# EasyEDA schematic SCH_280049核心板.json
TITLE: Sheet_1; REV: 1.0; Date: 2025-02-15; Sheet: 1/1; Drawn By: Qu♂; Company: Your Company
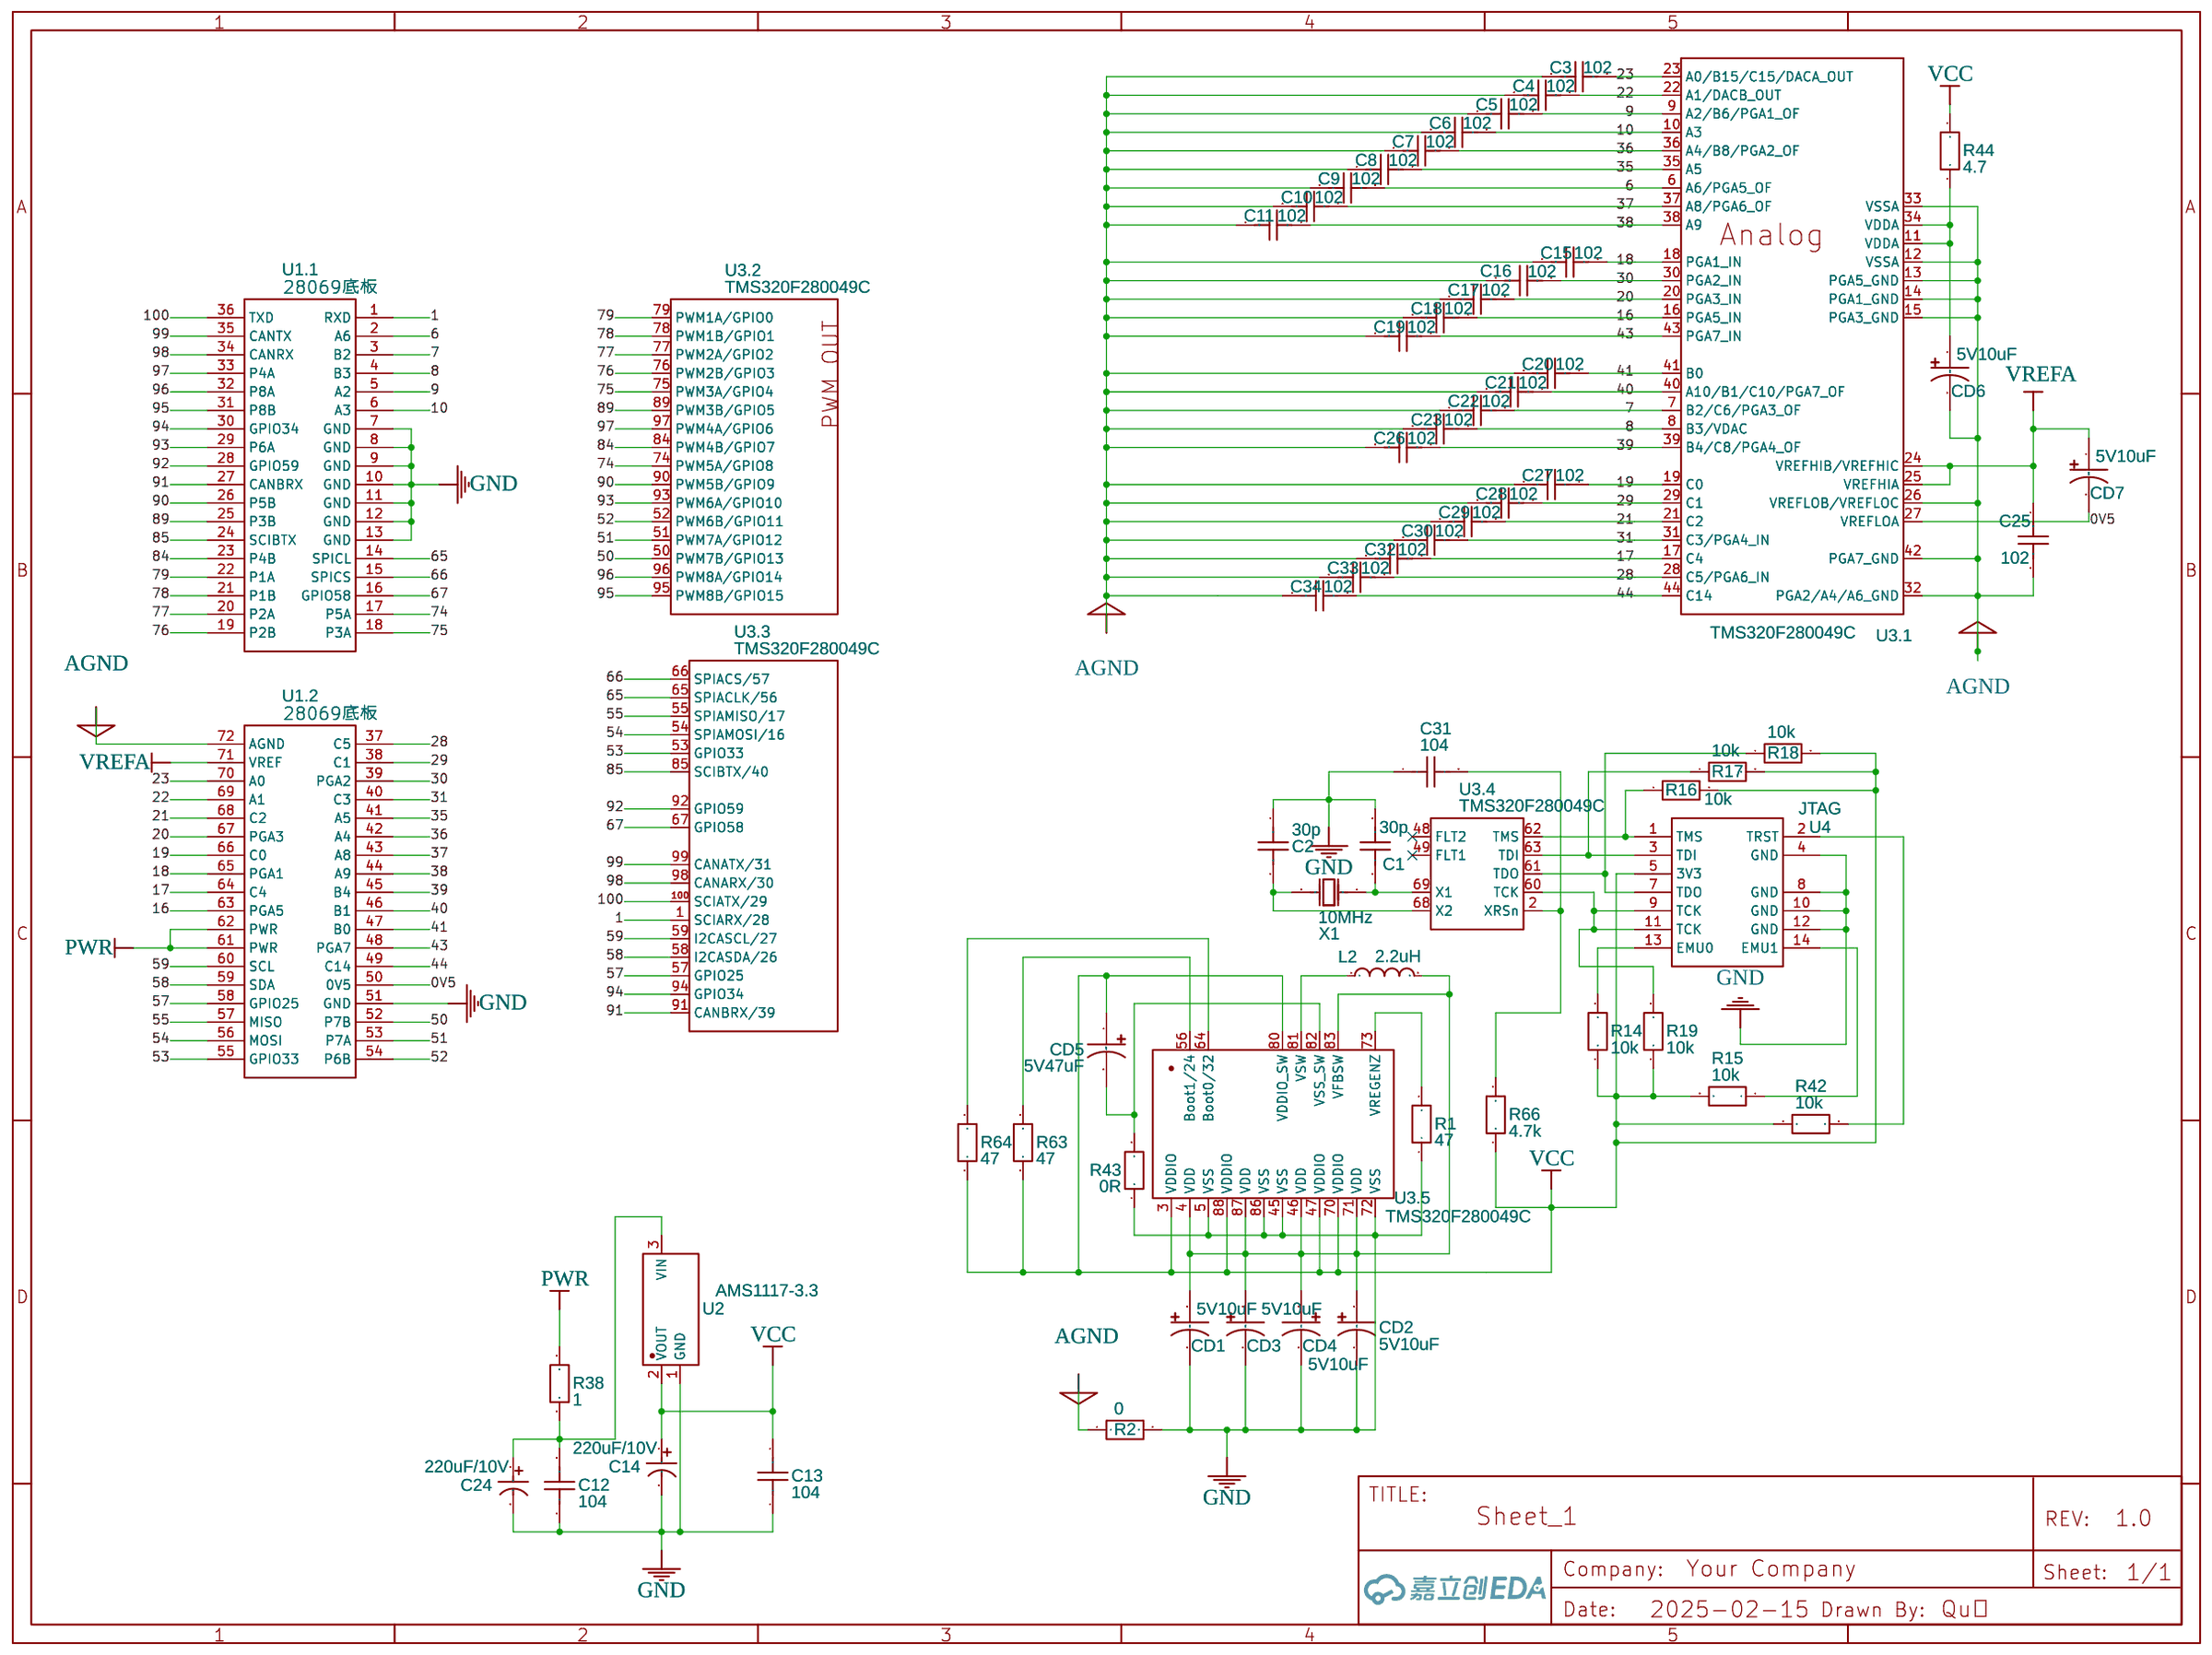
[diagram p0: schematic sheet]

## Parts
C1  30p  [C0402]
C2  30p  [C0402]
C3  102  [C0805]
C4  102  [C0805]
C5  102  [C0805]
C6  102  [C0805]
C7  102  [C0805]
C8  102  [C0805]
C9  102  [C0805]
C10  102  [C0805]
C11  102  [C0805]
C12  104  [C0603]
C13  104  [C0603]
C14  220uF/10V  [CAP-SMD_BD6.3-L6.6-W6.6-LS7.2-FD]
C15  102  [C0805]
C16  102  [C0805]
C17  102  [C0805]
C18  102  [C0805]
C19  102  [C0805]
C20  102  [C0805]
C21  102  [C0805]
C22  102  [C0805]
C23  102  [C0805]
C24  220uF/10V  [CAP-SMD_BD6.3-L6.6-W6.6-LS7.2-FD]
C25  102  [C0805]
C26  102  [C0805]
C27  102  [C0805]
C28  102  [C0805]
C29  102  [C0805]
C30  102  [C0805]
C31  104  [C0805]
C32  102  [C0805]
C33  102  [C0805]
C34  102  [C0805]
CD1  5V10uF  [CAP-SMD_L3.2-W1.6]
CD2  5V10uF  [CAP-SMD_L3.2-W1.6]
CD3  5V10uF  [CAP-SMD_L3.2-W1.6]
CD4  5V10uF  [CAP-SMD_L3.2-W1.6]
CD5  5V47uF  [CAP-SMD_L3.2-W1.6]
CD6  5V10uF  [CAP-SMD_L3.2-W1.6]
CD7  5V10uF  [CAP-SMD_L3.2-W1.6]
L2  2.2uH  [IND-SMD_L4.0-W4.0]
R1  47  [R0805]
R2  0  [R0805]
R14  10k  [R0805]
R15  10k  [R0805]
R16  10k  [R0805]
R17  10k  [R0805]
R18  10k  [R0805]
R19  10k  [R0805]
R38  1  [R0805]
R42  10k  [R0805]
R43  0R  [R0805]
R44  4.7  [R0805]
R63  47  [R0805]
R64  47  [R0805]
R66  4.7k  [R0805]
U1  28069底板  [280049底板]  (sections 1,2)
U2  AMS1117-3.3  [SOT-89-3_L4.5-W2.5-P1.50-LS4.2-BR]
U3  TMS320F280049C  [LQFP-100_L14.0-W14.0-P0.50-LS16.0-BL]  (sections 1,2,3,4,5)
U4  JTAG  [JTAG]
X1  10MHz  [HC-49S_L11.4-W4.8]

## Library data of the parts
C1 C2 = C_0402_US: Contributor: LCEDA_Lib
C3-C11 C15-C23 C25-C34 = C_0805_US: Contributor: LCEDA_Lib
C12 C13 = C_0603_US: Contributor: LCEDA_Lib
C14 C24 = 固态电容220UF/10V6.3*5.4: Contributor: LCSC; Supplier: LCSC; Supplier Part: C9900001736; Manufacturer Part: 固态电容220uF/10V6.3*5.4; JLCPCB Part Class: Extended Part; Manufacturer: null
CD1-CD7 = 5V10UF钽电容-3528: Contributor: LCSC; Supplier: LCSC; Supplier Part: C9900010526; Manufacturer: null; Manufacturer Part: 5v10uf钽电容-3528
L2 = ASPIAIG-S4035-2R2M-T: Supplier: LCSC; Supplier Part: C7217583; Manufacturer: ABRACON; Contributor: lcsc; JLCPCB Part Class: Extended Part
R1 R2 R14-R19 R38 R42-R44 R63 R64 R66 = R_0805_EU: Contributor: LCEDA_Lib
U1 = 28069底板: Contributor: Qu♂; subpart_no: 1
U2 = AMS1117-1.2S: Supplier: LCSC; Supplier Part: C5354987; Manufacturer: UMW(友台半导体); JLCPCB Part Class: Extended Part; Contributor: lcsc
U3 = TMS320F280049C: Manufacturer: TI(德州仪器); Manufacturer Part: 280049; subpart_no: 1; Contributor: paking_zhang; JLCPCB Part Class: Extended Part
U4 = JTAG: Contributor: paking_zhang
X1 = E49B11E0X000YE10C0: Contributor: LCSC; Supplier: LCSC; Manufacturer: HOSONIC(鸿星); Supplier Part: C126792; JLCPCB Part Class: Extended Part

## Nets
0V5: CD7.2 U1.50(0V5) U3.27(VREFLOA)
AGND: C3.2 C4.2 C5.2 C6.2 C7.2 C8.2 C9.2 C10.2 C11.2 C15.2 C16.2 C17.2 C18.2 C19.2 C20.2 C21.2 C22.2 C23.2 C25.2 C26.2 C27.2 C28.2 C29.2 C30.2 C32.2 C33.2 C34.2 CD6.2 R2.1 U1.72(AGND) U3.12(VSSA) U3.13(PGA5_GND) U3.14(PGA1_GND) U3.15(PGA3_GND) U3.26(VREFLOB/VREFLOC) U3.32(PGA2/A4/A6_GND) U3.33(VSSA) U3.42(PGA7_GND)
GND: C1.2 C2.1 C12.1 C13.1 C14.2 C24.2 C31.1 CD1.2 CD2.2 CD3.2 CD4.2 R1.1 R2.2 R43.1 U1.7(GND) U1.8(GND) U1.9(GND) U1.10(GND) U1.11(GND) U1.12(GND) U1.13(GND) U1.51(GND) U2.1(GND) U3.5(VSS) U3.45(VSS) U3.72(VSS) U3.86(VSS) U4.4(GND) U4.8(GND) U4.10(GND) U4.12(GND)
VCC: C13.2 C14.1 CD5.1 R14.1 R15.2 R16.2 R17.2 R18.2 R19.1 R42.2 R44.1 R63.1 R64.1 R66.1 U2.2(VOUT) U3.3(VDDIO) U3.47(VDDIO) U3.70(VDDIO) U3.80(VDDIO_SW) U3.88(VDDIO) U4.5(3V3)
1: U1.1(RXD) U3.1(SCIARX/28)
6: C9.1 U1.2(A6) U3.6(A6/PGA5_OF)
7: C22.1 U1.3(B2) U3.7(B2/C6/PGA3_OF)
8: C23.1 U1.4(B3) U3.8(B3/VDAC)
9: C5.1 U1.5(A2) U3.9(A2/B6/PGA1_OF)
10: C6.1 U1.6(A3) U3.10(A3)
16: C18.1 U1.63(PGA5) U3.16(PGA5_IN)
17: C32.1 U1.64(C4) U3.17(C4)
18: C15.1 U1.65(PGA1) U3.18(PGA1_IN)
19: C27.1 U1.66(C0) U3.19(C0)
20: C17.1 U1.67(PGA3) U3.20(PGA3_IN)
21: C29.1 U1.68(C2) U3.21(C2)
22: C4.1 U1.69(A1) U3.22(A1/DACB_OUT)
23: C3.1 U1.70(A0) U3.23(A0/B15/C15/DACA_OUT)
28: C33.1 U1.37(C5) U3.28(C5/PGA6_IN)
29: C28.1 U1.38(C1) U3.29(C1)
30: C16.1 U1.39(PGA2) U3.30(PGA2_IN)
31: C30.1 U1.40(C3) U3.31(C3/PGA4_IN)
35: C8.1 U1.41(A5) U3.35(A5)
36: C7.1 U1.42(A4) U3.36(A4/B8/PGA2_OF)
37: C10.1 U1.43(A8) U3.37(A8/PGA6_OF)
38: C11.1 U1.44(A9) U3.38(A9)
39: C26.1 U1.45(B4) U3.39(B4/C8/PGA4_OF)
40: C21.1 U1.46(B1) U3.40(A10/B1/C10/PGA7_OF)
41: C20.1 U1.47(B0) U3.41(B0)
43: C19.1 U1.48(PGA7) U3.43(PGA7_IN)
44: C34.1 U1.49(C14) U3.44(C14)
50: U1.52(P7B) U3.50(PWM7B/GPIO13)
51: U1.53(P7A) U3.51(PWM7A/GPIO12)
52: U1.54(P6B) U3.52(PWM6B/GPIO11)
53: U1.55(GPIO33) U3.53(GPIO33)
54: U1.56(MOSI) U3.54(SPIAMOSI/16)
55: U1.57(MISO) U3.55(SPIAMISO/17)
57: U1.58(GPIO25) U3.57(GPIO25)
58: U1.59(SDA) U3.58(I2CASDA/26)
59: U1.60(SCL) U3.59(I2CASCL/27)
65: U1.14(SPICL) U3.65(SPIACLK/56)
66: U1.15(SPICS) U3.66(SPIACS/57)
67: U1.16(GPIO58) U3.67(GPIO58)
74: U1.17(P5A) U3.74(PWM5A/GPIO8)
75: U1.18(P3A) U3.75(PWM3A/GPIO4)
76: U1.19(P2B) U3.76(PWM2B/GPIO3)
77: U1.20(P2A) U3.77(PWM2A/GPIO2)
78: U1.21(P1B) U3.78(PWM1B/GPIO1)
79: U1.22(P1A) U3.79(PWM1A/GPIO0)
84: U1.23(P4B) U3.84(PWM4B/GPIO7)
85: U1.24(SCIBTX) U3.85(SCIBTX/40)
89: U1.25(P3B) U3.89(PWM3B/GPIO5)
90: U1.26(P5B) U3.90(PWM5B/GPIO9)
91: U1.27(CANBRX) U3.91(CANBRX/39)
92: U1.28(GPIO59) U3.92(GPIO59)
93: U1.29(P6A) U3.93(PWM6A/GPIO10)
94: U1.30(GPIO34) U3.94(GPIO34)
95: U1.31(P8B) U3.95(PWM8B/GPIO15)
96: U1.32(P8A) U3.96(PWM8A/GPIO14)
97: U1.33(P4A) U3.97(PWM4A/GPIO6)
98: U1.34(CANRX) U3.98(CANARX/30)
99: U1.35(CANTX) U3.99(CANATX/31)
100: U1.36(TXD) U3.100(SCIATX/29)
PWR: R38.2 U1.61(PWR) U1.62(PWR)
VREFA: C25.1 CD7.1 U1.71(VREF) U3.24(VREFHIB/VREFHIC) U3.25(VREFHIA)
Net-(C1-1): C1.1 U3.69(X1) X1.1(OSC1)
Net-(C2-2): C2.2 U3.68(X2) X1.2(OSC2)
Net-(C12-2): C12.2 C24.1 R38.1 U2.3(VIN)
Net-(C31-2): C31.2 R66.2 U3.2(XRSn)
Net-(CD1-1): CD1.1 CD2.1 CD3.1 CD4.1 L2.2 U3.4(VDD) U3.46(VDD) U3.71(VDD) U3.83(VFBSW) U3.87(VDD)
Net-(CD5-2): CD5.2 R43.2 U3.82(VSS_SW)
Net-(CD6-1): CD6.1 R44.2 U3.11(VDDA) U3.34(VDDA)
Net-(L2-1): L2.1 U3.81(VSW)
Net-(R1-2): R1.2 U3.73(VREGENZ)
Net-(R14-2): R14.2 U4.13(EMU0)
Net-(R15-1): R15.1 U4.14(EMU1)
Net-(R16-1): R16.1 U3.62(TMS) U4.1(TMS)
Net-(R17-1): R17.1 U3.63(TDI) U4.3(TDI)
Net-(R18-1): R18.1 U3.61(TDO) U4.7(TDO)
Net-(R19-2): R19.2 U3.60(TCK) U4.9(TCK) U4.11(TCK)
Net-(R42-1): R42.1 U4.2(TRST)
Net-(R63-2): R63.2 U3.56(Boot1/24)
Net-(R64-2): R64.2 U3.64(Boot0/32)

Not connected (* = marked no-connect by the designer): U3 48(FLT2)* 49(FLT1)*
